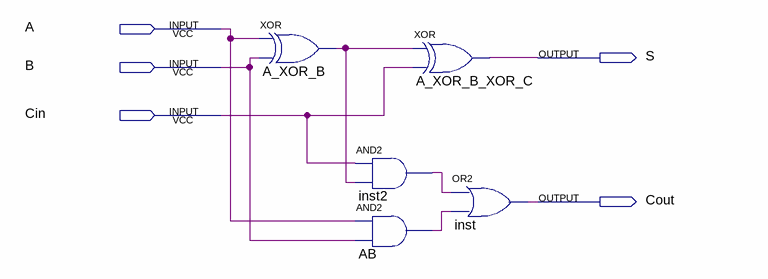
[diagram p0: schematic sheet]
// Quartus schematic FA.bdf as structural Verilog: 5 symbols, 5 pins
module FA (
  input  A,
  input  B,
  input  Cin,
  output S,
  output Cout
);

  wire A_XOR_B_out, AB_out, inst2_out;

  xor A_XOR_B (A_XOR_B_out, A, B);
  xor A_XOR_B_XOR_C (S, A_XOR_B_out, Cin);
  and inst2 (inst2_out, Cin, A_XOR_B_out);
  and AB (AB_out, A, B);
  or inst (Cout, inst2_out, AB_out);
endmodule
